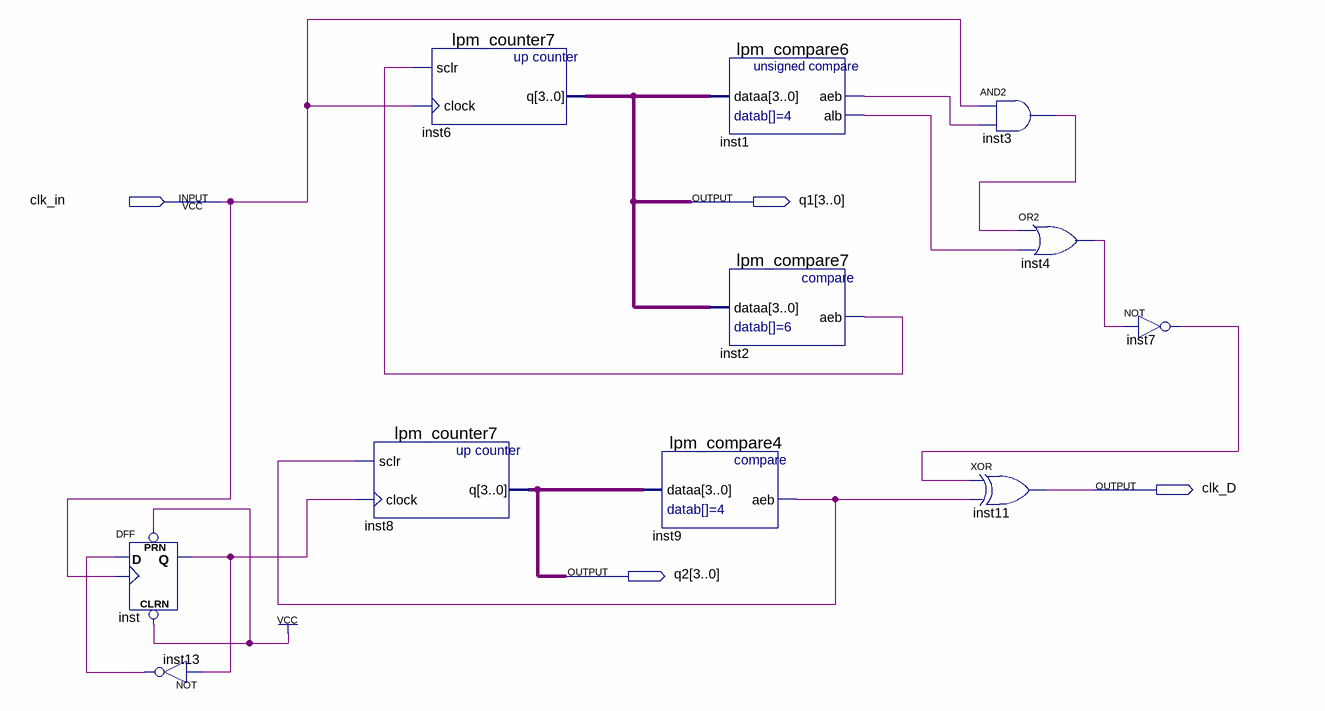
[diagram p0: schematic sheet]
// Quartus schematic Block2.bdf as structural Verilog: 11 symbols, 4 pins
module Block2 (
  input  clk_in,
  output [3:0] q1,
  output clk_D,
  output [3:0] q2
);

  wire inst1_aeb, inst1_alb, inst2_aeb, inst3_out, inst4_out, inst7_out, inst9_aeb, inst13_out, inst_q;

  DFF inst (.CLRN(1'b1), .CLK(clk_in), .D(inst13_out), .PRN(1'b1), .Q(inst_q));
  not inst13 (inst13_out, inst_q);
  lpm_counter7 inst6 (.sclr(inst2_aeb), .clock(clk_in), .q(q1));
  lpm_counter7 inst8 (.sclr(inst9_aeb), .clock(inst_q), .q(q2));
  lpm_compare4 inst9 (.dataa(q2), .aeb(inst9_aeb));
  lpm_compare6 inst1 (.dataa(q1), .aeb(inst1_aeb), .alb(inst1_alb));
  lpm_compare7 inst2 (.dataa(q1), .aeb(inst2_aeb));
  and inst3 (inst3_out, clk_in, inst1_aeb);
  or inst4 (inst4_out, inst3_out, inst1_alb);
  xor inst11 (clk_D, inst7_out, inst9_aeb);
  not inst7 (inst7_out, inst4_out);
endmodule
